# Altium schematic sheet Sheet1.SchDoc
size A2; SheetNumber: 1; SheetTotal: 1
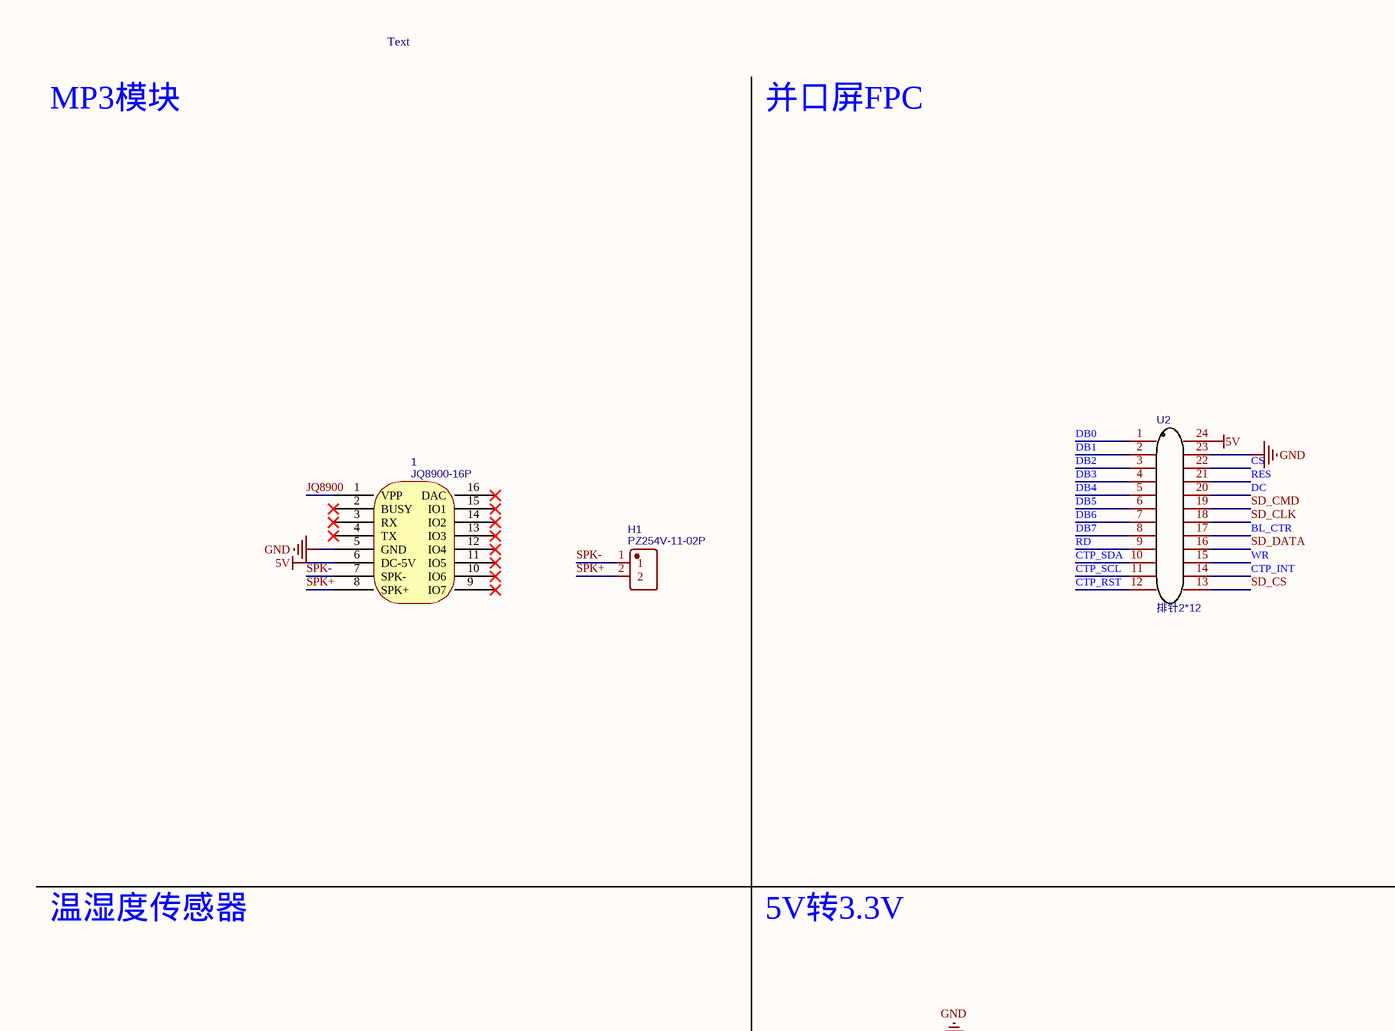
[diagram p0: Sheet1.SchDoc, top left]
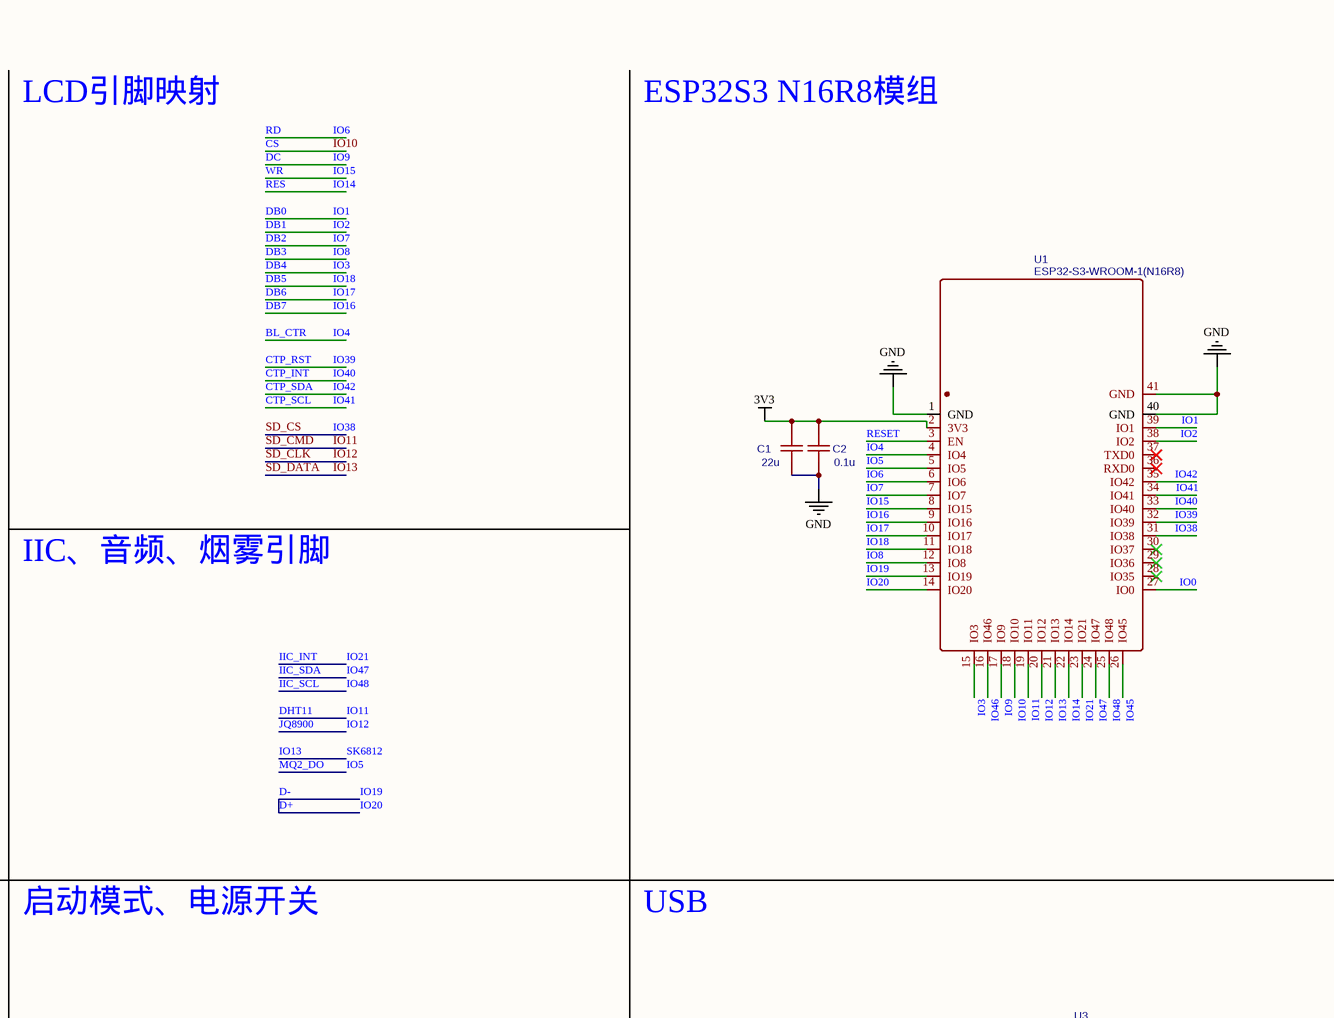
[diagram p1: Sheet1.SchDoc, top right]
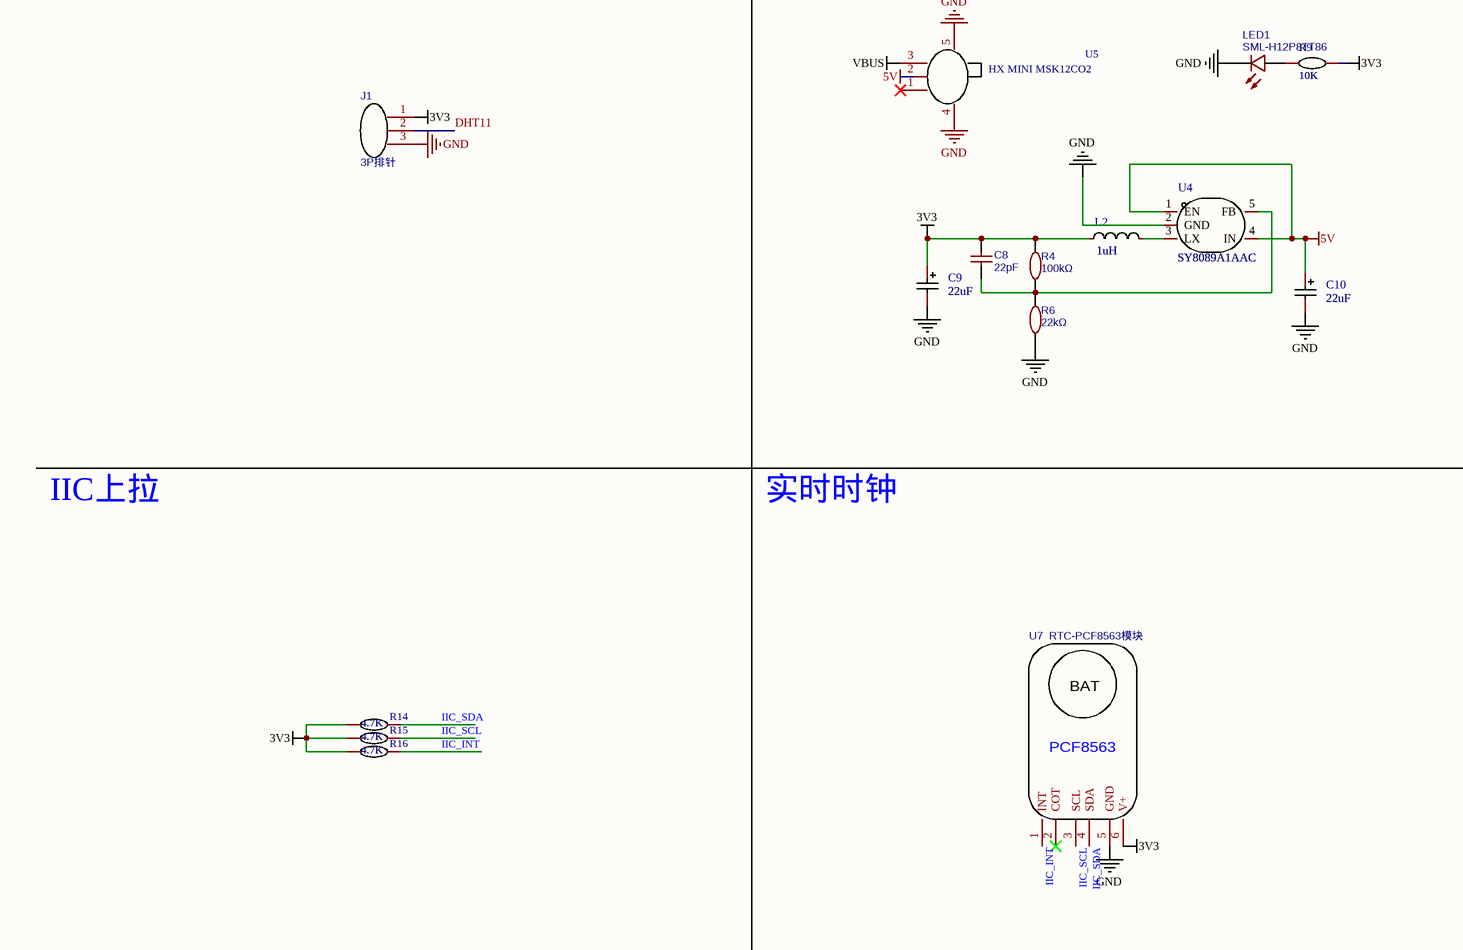
[diagram p2: Sheet1.SchDoc, bottom left]
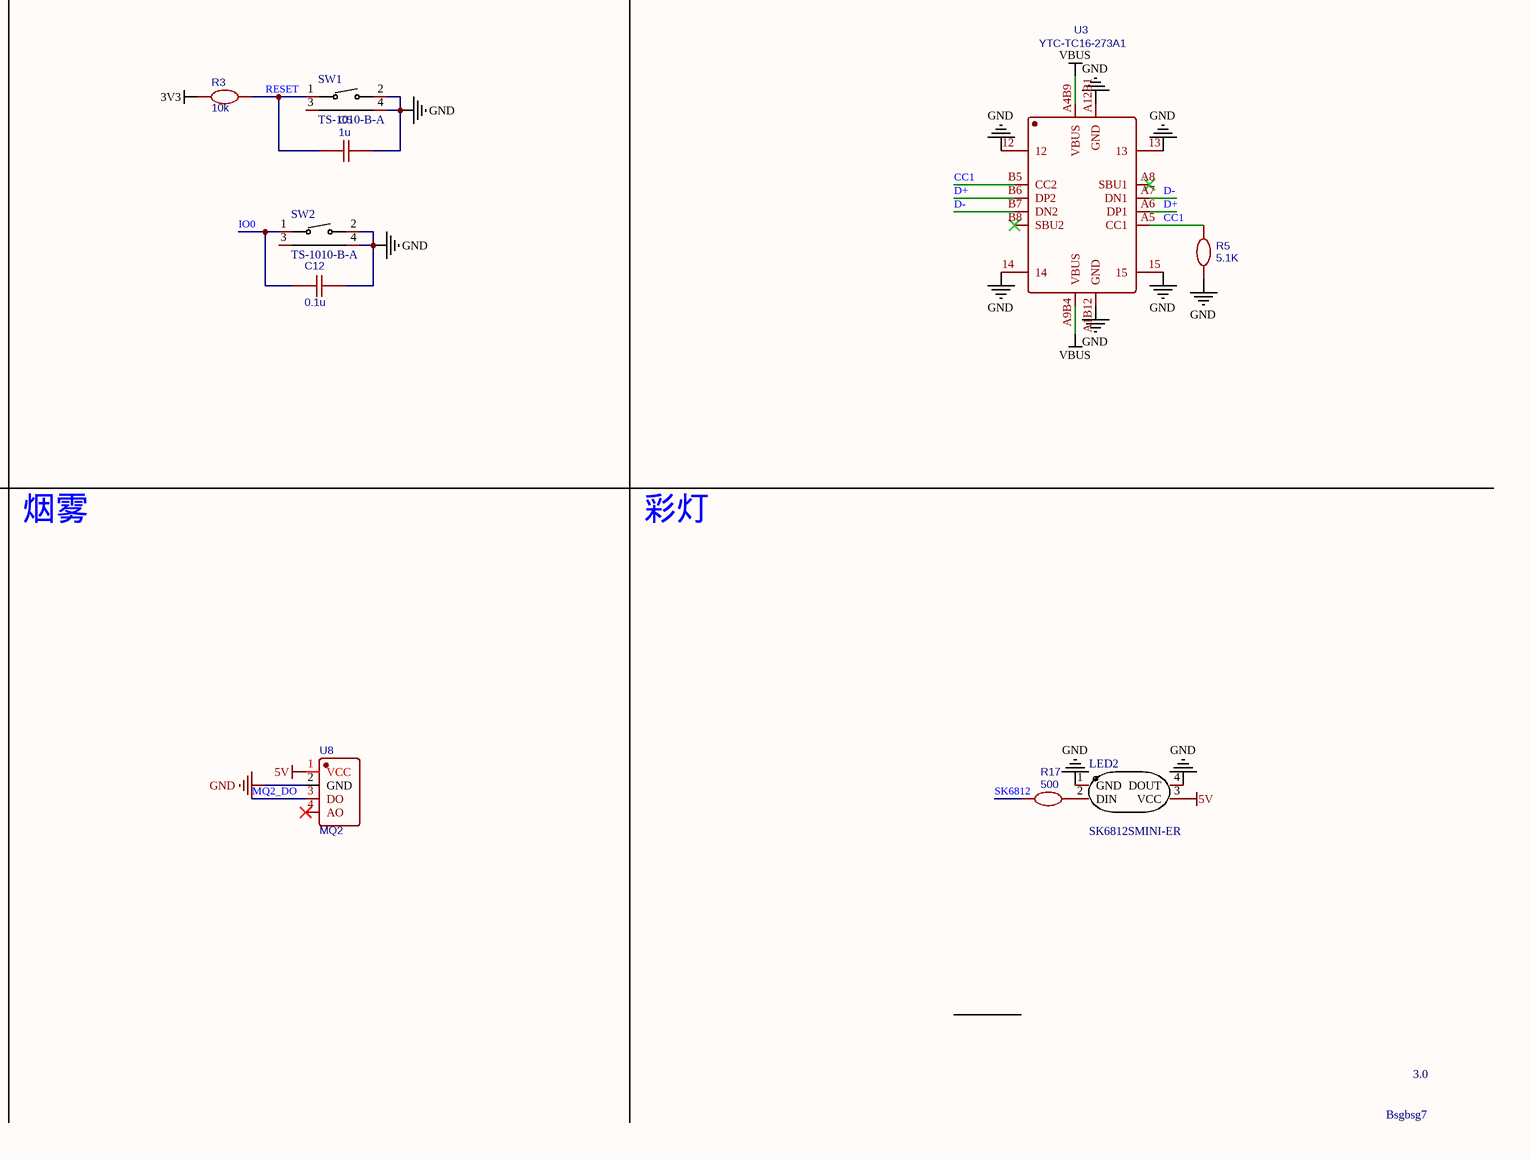
[diagram p3: Sheet1.SchDoc, bottom right]

## Parts
1  JQ8900-16P  [JQ8900-16P]
C1  22u  [C0603]
C2  0.1u  [C0603]
C5  1u  [C0603]
C8  22pF  [C0603]
C9  22uF  [CASE-B_3528]
C10  22uF  [CASE-B_3528]
C12  0.1u  [C0603]
H1  PZ254V-11-02P  [HDR-TH_2P-P2.54-V-M]
J1  3P排针  [DHT]
L2  1uH  [IND-SMD_L3.2-W3.2-1]
LED1  SML-H12P8TT86  [LED0805-R-RD_GREEN]
LED2  SK6812SMINI-ER  [SK6812]
R3  10k  [R0603]
R4  100kΩ  [R0603]
R5  5.1K  [R0603]
R6  22kΩ  [R0603]
R9  10K  [R0603]  (value not drawn)
R14  4.7K  [R0603]
R15  4.7K  [R0603]
R16  4.7K  [R0603]
R17  500  [R0603]
SW1  TS-1010-B-A  [KEY-SMD_TX-1010-X-X]
SW2  TS-1010-B-A  [KEY-SMD_TX-1010-X-X]
U1  ESP32-S3-WROOM-1(N16R8)  [WIRELM-SMD_ESP32-S3-WROOM-1]
U2  排针2*12  [PCBComponent_1 - duplicate]
U3  YTC-TC16-273A1  [TYPE-C-SMD_YIYUAN_YTC-TC16-273A1]
U4  SY8089A1AAC  [TSOT-23-5_L2.9-W1.6-P0.95-LS2.8-BR]
U5  HX MINI MSK12CO2  [SW-SMD_MSK12CO2]  (value not drawn)
U7  RTC-PCF8563模块  [PCF8563模块]
U8  MQ2  [MQ2]

## Nets
3V3: C1.1 C2.2 C8.2 C9.1 J1.1 L2.1 R3.1 R4.2 R9.2 R14.1 R15.1 R16.1 U1.2(3V3) U7.6(V+)
5V: 1.6(DC-5V) C10.1 LED2.3(VCC) U2.24 U4.1(EN) U4.4(IN) U5.2 U8.1(VCC)
GND: 1.5(GND) C1.2 C2.1 C5.2 C9.2 C10.2 C12.1 J1.3 LED1.2(C) LED2.1(GND) LED2.4(DOUT) R5.2 R6.1 SW1.2 SW1.4 SW2.2 SW2.4 U1.1(GND) U1.40(GND) U1.41(GND) U2.23 U3.12 U3.13 U3.14 U3.15 U3.A1B12(GND) U3.A12B1(GND) U4.2(GND) U5.4 U5.5 U7.5(GND) U8.2(GND)
VBUS: U3.A4B9(VBUS) U3.A9B4(VBUS) U5.3
BL_CTR: U1.4(IO4) U2.17  [also labelled IO4]
CC1: R5.1 U3.A5(CC1) U3.B5(CC2)
CS: U1.18(IO10) U2.22  [also labelled IO10]
CTP_INT: U1.33(IO40) U2.14  [also labelled IO40]
CTP_RST: U1.32(IO39) U2.12  [also labelled IO39]
CTP_SCL: U1.34(IO41) U2.11  [also labelled IO41]
CTP_SDA: U1.35(IO42) U2.10  [also labelled IO42]
D+: U1.13(IO19) U1.14(IO20) U3.A6(DP1) U3.A7(DN1) U3.B6(DP2) U3.B7(DN2)  [also labelled D-, IO19, IO20]
DB0: U1.39(IO1) U2.1  [also labelled IO1]
DB1: U1.38(IO2) U2.2  [also labelled IO2]
DB2: U1.7(IO7) U2.3  [also labelled IO7]
DB3: U1.12(IO8) U2.4  [also labelled IO8]
DB4: U1.15(IO3) U2.5  [also labelled IO3]
DB5: U1.11(IO18) U2.6  [also labelled IO18]
DB6: U1.10(IO17) U2.7  [also labelled IO17]
DB7: U1.9(IO16) U2.8  [also labelled IO16]
DC: U1.17(IO9) U2.20  [also labelled IO9]
DHT11: J1.2 U1.19(IO11) U2.19  [also labelled IO11, SD_CMD]
IIC_INT: R16.2 U1.23(IO21) U7.1(INT)  [also labelled IO21]
IIC_SCL: R15.2 U1.25(IO48) U7.3(SCL)  [also labelled IO48]
IIC_SDA: R14.2 U1.24(IO47) U7.4(SDA)  [also labelled IO47]
IO0: C12.2 SW2.1 U1.27(IO0)
IO5: U1.5(IO5) U8.3(DO)  [also labelled MQ2_DO]
IO6: U1.6(IO6) U2.9  [also labelled RD]
IO12: 1.1(VPP) U1.20(IO12) U2.18  [also labelled JQ8900, SD_CLK]
IO13: R17.1 U1.21(IO13) U2.16  [also labelled SD_DATA, SK6812]
IO14: U1.22(IO14) U2.21  [also labelled RES]
IO15: U1.8(IO15) U2.15  [also labelled WR]
IO38: U1.31(IO38) U2.13  [also labelled SD_CS]
IO45: U1.26(IO45)
IO46: U1.16(IO46)
RESET: C5.1 R3.2 SW1.1 U1.3(EN)
SPK+: 1.8(SPK+) H1.2
SPK-: 1.7(SPK-) H1.1
NetC8_1: C8.1 R4.1 R6.2 U4.5(FB)
NetL2_2: L2.2 U4.3(LX)
NetLED1_1: LED1.1(A) R9.1
NetLED2_2: LED2.2(DIN) R17.2

Not connected (* = marked no-connect by the designer): 1 2(BUSY)* 3(RX)* 4(TX)* 9(IO7)* 10(IO6)* 11(IO5)* 12(IO4)* 13(IO3)* 14(IO2)* 15(IO1)* 16(DAC)*; SW1 3; SW2 3; U1 28(IO35)* 29(IO36)* 30(IO37)* 36(RXD0)* 37(TXD0)*; U3 A8(SBU1)* B8(SBU2)*; U5 1*; U7 2(COT)*; U8 4(AO)*

## Notes on the sheet
- Text
- MP3模块
- 并口屏FPC
- LCD引脚映射
- ESP32S3 N16R8模组
- IIC、音频、烟雾引脚
- 温湿度传感器
- 5V转3.3V
- 启动模式、电源开关
- USB
- IIC上拉
- 实时时钟
- 烟雾
- 彩灯
- Bsgbsg7
- 3.0
- (in symbol RTC-PCF8563模块) BAT; PCF8563

## Library data of the parts
1 = JQ8900-16P: Contributor: gfd1; spicePre: ?; spiceSymbolName: JQ8900-16P
C1 = 22u: nameAlias: Value(F); Contributor: LCEDA_Lib; spicePre: C; spiceSymbolName: C_0603_US
C2 C12 = 0.1u: nameAlias: Value(F); Contributor: LCEDA_Lib; spicePre: C; spiceSymbolName: C_0603_US
C5 = 1u: nameAlias: Value(F); Contributor: LCEDA_Lib; spicePre: C; spiceSymbolName: C_0603_US
C8 = 22pF: BOM_Manufacturer Part: CL10C220JB8NNNC; BOM_Manufacturer: SAMSUNG(三星); nameAlias: Capacitance; BOM_Supplier: LCSC; BOM_Supplier Part: C1653; BOM_JLCPCB Part Class: Basic Part; spicePre: C; spiceSymbolName: CL10C220JB8NNNC
C9 C10 = TAJB226K016RNJ: 容值:22uF;精度:±10%;额定电压:16V;等效串联电阻:2.3Ω@100kHz;工作温度:-55℃~+125℃;; Manufacturer: Kyocera AVX; Add into BOM: yes; Tolerance: ±10%; Rated Voltage: 16V; Name: 22uF; Symbol: TAJB226K016RNJ; Device: TAJB226K016RNJ; LCSC Part Name: 22uF ±10% 16V; Supplier Part: C8020; Manufacturer Part: TAJB226K016RNJ; Supplier Footprint: CASE-B_3528; JLCPCB Part Class: Extended Part; Datasheet: https://atta.szlcsc.com/upload/public/pdf/source/20160107/1457707749964.pdf; Supplier: LCSC; Convert to PCB: yes; Value: 22uF; Equivalent Series Resistance(ESR): 2.3Ω@100kHz; Operating Temperature: -55℃~+125℃
H1 = PZ254V-11-02P: BOM_Manufacturer: XFCN(兴飞); Contributor: LCSC; BOM_Supplier: LCSC; BOM_Supplier Part: C492401; BOM_Manufacturer Part: PZ254V-11-02P; BOM_JLCPCB Part Class: Extended Part; spicePre: H; spiceSymbolName: PZ254V-11-02P
J1 = 3P排针: Contributor: 878738424; spicePre: J; spiceSymbolName: 3P排针
L2 = TMPC0302H-1R0MG: 电感值:1uH;精度:±20%;额定电流:4A;直流电阻(DCR):32mΩ;; Manufacturer: TAI-TECH(台庆); Add into BOM: yes; Tolerance: ±20%; Rated Current: 4A; DC Resistance (DCR): 32mΩ; Name: 1uH; Symbol: TMPC0302H-1R0MG; Device: TMPC0302H-1R0MG; LCSC Part Name: 1uH ±20%; Supplier Part: C357122; Manufacturer Part: TMPC0302H-1R0MG; Supplier Footprint: SMD; JLCPCB Part Class: Extended Part; Datasheet: https://atta.szlcsc.com/upload/public/pdf/source/20200917/C357122_6F527967014A5480A7BF1930E1412AC6.pdf; Supplier: LCSC; Convert to PCB: yes; Value: 1uH; Width: 3.2mm; Height: 1.8mm; Length: 3.5mm
LED1 = SML-H12P8TT86: BOM_Manufacturer: ROHM(罗姆); Contributor: lcsc; BOM_Supplier: LCSC; BOM_Supplier Part: C510035; BOM_Manufacturer Part: SML-H12P8TT86; BOM_JLCPCB Part Class: Extended Part; spicePre: L; spiceSymbolName: SML-H12P8TT86
LED2 = SK6812SMINI-ER: Manufacturer: 欧思科光电; Add into BOM: yes; Symbol: SK6812SMINI-ER; Device: SK6812SMINI-ER; LCSC Part Name: SK6812SMINI-ER; Supplier Part: C5142047; Manufacturer Part: SK6812SMINI-ER; Supplier Footprint: SMD2835; JLCPCB Part Class: Extended Part; Datasheet: https://atta.szlcsc.com/upload/public/pdf/source/20220812/283F2CDBF03DB3CA48F090CE4F009622.pdf; Supplier: LCSC; Convert to PCB: yes; Name: SK6812SMINI-ER
R3 R5 = 5.1K: nameAlias: Value(Ω); Contributor: LCEDA_Lib; spicePre: R; spiceSymbolName: R_0603_EU
R4 = 100kΩ: BOM_Manufacturer: UNI-ROYAL(厚声); BOM_Manufacturer Part: 0603WAF1003T5E; nameAlias: Resistance; Resistance (Ohms): 100K; BOM_Supplier: LCSC; BOM_Supplier Part: C25803; BOM_JLCPCB Part Class: Basic Part; spicePre: R; spiceSymbolName: 0603WAF1003T5E
R6 = 22kΩ: BOM_Manufacturer: UNI-ROYAL(厚声); BOM_Manufacturer Part: 0603WAF2202T5E; nameAlias: Resistance; Resistance (Ohms): 22K; BOM_Supplier: LCSC; BOM_Supplier Part: C31850; BOM_JLCPCB Part Class: Basic Part; spicePre: R; spiceSymbolName: 0603WAF2202T5E
R9 = 10K: Symbol: 电阻; Device: Res_0603; Convert to PCB: yes; Name: 10K; Add into BOM: yes; Supplier Footprint: 0603
R14-R16 = 4.7K: Manufacturer: YAGEO; Symbol: 10K; Device: AF0603FR-0710KL; Convert to PCB: yes; Origin Footprint: 0603; Name: 4.7K; Supplier: LCSC; Manufacturer Part: AF0603FR-0710KL; Supplier Part: C144081; Add into BOM: yes
R17 = 1.2K: nameAlias: Value(Ω); Contributor: LCEDA_Lib; spicePre: R; spiceSymbolName: R_0603_EU
SW1 SW2 = TS-1010-B-A: 触点电流:50mA;额定电压(DC):12V;绝缘电阻:-;电路结构:单刀单掷;安装方式:卧贴;按钮形状:矩形按钮;按钮/盖帽颜色:黑色;带灯:无;作用力:160gf;机械寿命:100000;工作温度:-30℃~+85℃;开关长度:4.7mm;开关宽度:1.9mm;开关高度:3.5mm;带支架:否;; Manufacturer: XKB Connectivity(中国星坤); Add into BOM: yes; Contact Current: 50mA; Voltage Rating (DC): 12V; Circuit: 单刀单掷; Actuator Style: 矩形按钮; Actuator/Cap Color: 黑色; With Lamp: 无; Operating Force: 160gf; Mechanical Life: 100000; Switch Length: 4.7mm; Switch Width: 1.9mm; Switch Height: 3.5mm; Strike Gundam: 否; Symbol: TS-1010-B-A; Device: TS-1010-B-A; LCSC Part Name: 1.9*4.7*3.5小侧按160gf带固定柱; Supplier Part: C318941; Manufacturer Part: TS-1010-B-A; Supplier Footprint: SMD; JLCPCB Part Class: Extended Part; Datasheet: https://atta.szlcsc.com/upload/public/pdf/source/20200227/C318941_A5A5DBAB1B24E3EFC34CEC5510EE9B45.pdf; Supplier: LCSC; Convert to PCB: yes; Insulation Resistance: -; Mounting Style: 卧贴; Operating Temperature: -30℃~+85℃
U1 = ESP32-S3-WROOM-1(N16R8): BOM_Manufacturer: ESPRESSIF(乐鑫); BOM_Manufacturer Part: ESP32-S3-WROOM-1-N16R8; Contributor: lcsc; BOM_Supplier: LCSC; BOM_Supplier Part: C2913202; link: https://atta.szlcsc.com/upload/public/pdf/source/20220705/4E799F39581577F766659887F738A439.pdf; BOM_JLCPCB Part Class: Extended Part; spicePre: U; spiceSymbolName: ESP32-S3-WROOM-1(N16R8)
U2 = 排针2*12: Contributor: Leshushi; spicePre: U; spiceSymbolName: 排针2*12
U3 = YTC-TC16-273A1: BOM_Manufacturer: YIYUAN(怡远); Contributor: lcsc; BOM_Supplier: LCSC; BOM_Supplier Part: C5260486; BOM_Manufacturer Part: YTC-TC16-273A1; link: https://atta.szlcsc.com/upload/public/pdf/source/20221115/1C643958E5C7CDCF6F0D7C93477BAFEB.pdf; BOM_JLCPCB Part Class: Extended Part; spicePre: U; spiceSymbolName: YTC-TC16-273A1
U4 = SY8089A1AAC: Manufacturer: silergy(矽力杰); Add into BOM: yes; Name: SY8089A1AAC; Symbol: SY8089A1AAC; Device: SY8089A1AAC; LCSC Part Name: SY8089A1AAC; Supplier Part: C479074; Manufacturer Part: SY8089A1AAC; Supplier Footprint: SOT-23-5; JLCPCB Part Class: Extended Part; Datasheet: https://atta.szlcsc.com/upload/public/pdf/source/20200117/C479074_09E605B8BDE11DB5A08573B7E6429A0D.pdf; Supplier: LCSC; Convert to PCB: yes
U5 = HX MINI MSK12CO2: Manufacturer: hanxia(韩下); Add into BOM: yes; Switch Length: 5mm; Switch Width: 2.75mm; Switch Height: 1.45mm; Name: HX MINI MSK12CO2; Symbol: HX MINI MSK12CO2; Device: HX MINI MSK12CO2; Supplier Part: C5149840; Manufacturer Part: HX MINI MSK12CO2; Supplier Footprint: SMD; JLCPCB Part Class: Extended Part; Datasheet: https://atta.szlcsc.com/upload/public/pdf/source/20220907/C5D739AFE38DE8F4177754FEAD8EFFD1.pdf; Supplier: LCSC; Convert to PCB: yes
U7 = RTC-PCF8563模块: BOM_Manufacturer: Xu; BOM_Manufacturer Part: Xu4388; Contributor: XDesign; BOM_Supplier: Xu; BOM_Supplier Part: Xu4388; spicePre: U; spiceSymbolName: RTC-PCF8563模块
U8 = MQ2: Contributor: 1898stark; spicePre: U; spiceSymbolName: MQ2